# Altium schematic sheet JTAG.SchDoc
size A
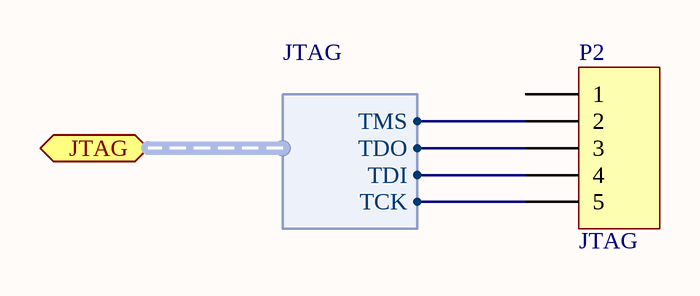
[diagram p0: JTAG.SchDoc]

## Parts
P2  JTAG  [HDR1X5]

## Ports
JTAG (harness JTAG)

## Harnesses
JTAG: TCK, TDI, TDO, TMS

## Nets
NetP2_2: P2.2 ; port JTAG.TMS
NetP2_3: P2.3 ; port JTAG.TDO
NetP2_4: P2.4 ; port JTAG.TDI
NetP2_5: P2.5 ; port JTAG.TCK

Not connected (* = marked no-connect by the designer): P2 1

## Library data of the parts
P2 = Header 5: Header, 5-Pin; LatestRevisionDate: 17-Jul-2002; LatestRevisionNote: Re-released for DXP Platform.; Publisher: Altium Limited